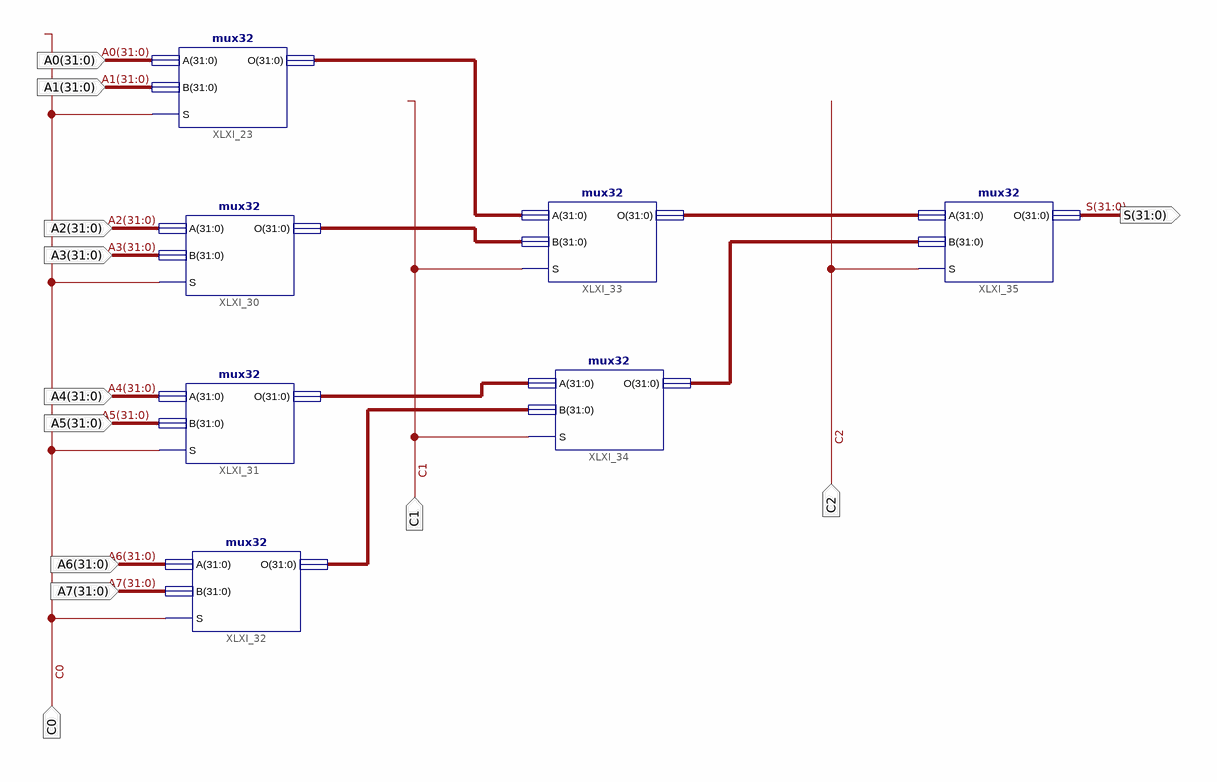
[diagram p0: schematic sheet 1]
// Xilinx ISE schematic mux32_8_1.sch (artix7) as structural Verilog: 7 symbols, 12 ports
module mux32_8_1 (
  input  [31:0] A0,
  input  [31:0] A1,
  input  [31:0] A2,
  input  [31:0] A3,
  input  [31:0] A4,
  input  [31:0] A5,
  input  [31:0] A6,
  input  [31:0] A7,
  input  C1,
  input  C0,
  input  C2,
  output [31:0] S
);

  wire [31:0] XLXN_74, XLXN_75, XLXN_76, XLXN_79, XLXN_82, XLXN_83;

  mux32 XLXI_23 (.A(A0), .B(A1), .S(C0), .O(XLXN_75));
  mux32 XLXI_30 (.A(A2), .B(A3), .S(C0), .O(XLXN_76));
  mux32 XLXI_31 (.A(A4), .B(A5), .S(C0), .O(XLXN_79));
  mux32 XLXI_32 (.A(A6), .B(A7), .S(C0), .O(XLXN_74));
  mux32 XLXI_33 (.A(XLXN_75), .B(XLXN_76), .S(C1), .O(XLXN_83));
  mux32 XLXI_34 (.A(XLXN_79), .B(XLXN_74), .S(C1), .O(XLXN_82));
  mux32 XLXI_35 (.A(XLXN_83), .B(XLXN_82), .S(C2), .O(S));
endmodule
